# EasyEDA Pro project KeysDock.eprj, board pcb-keyboard-old
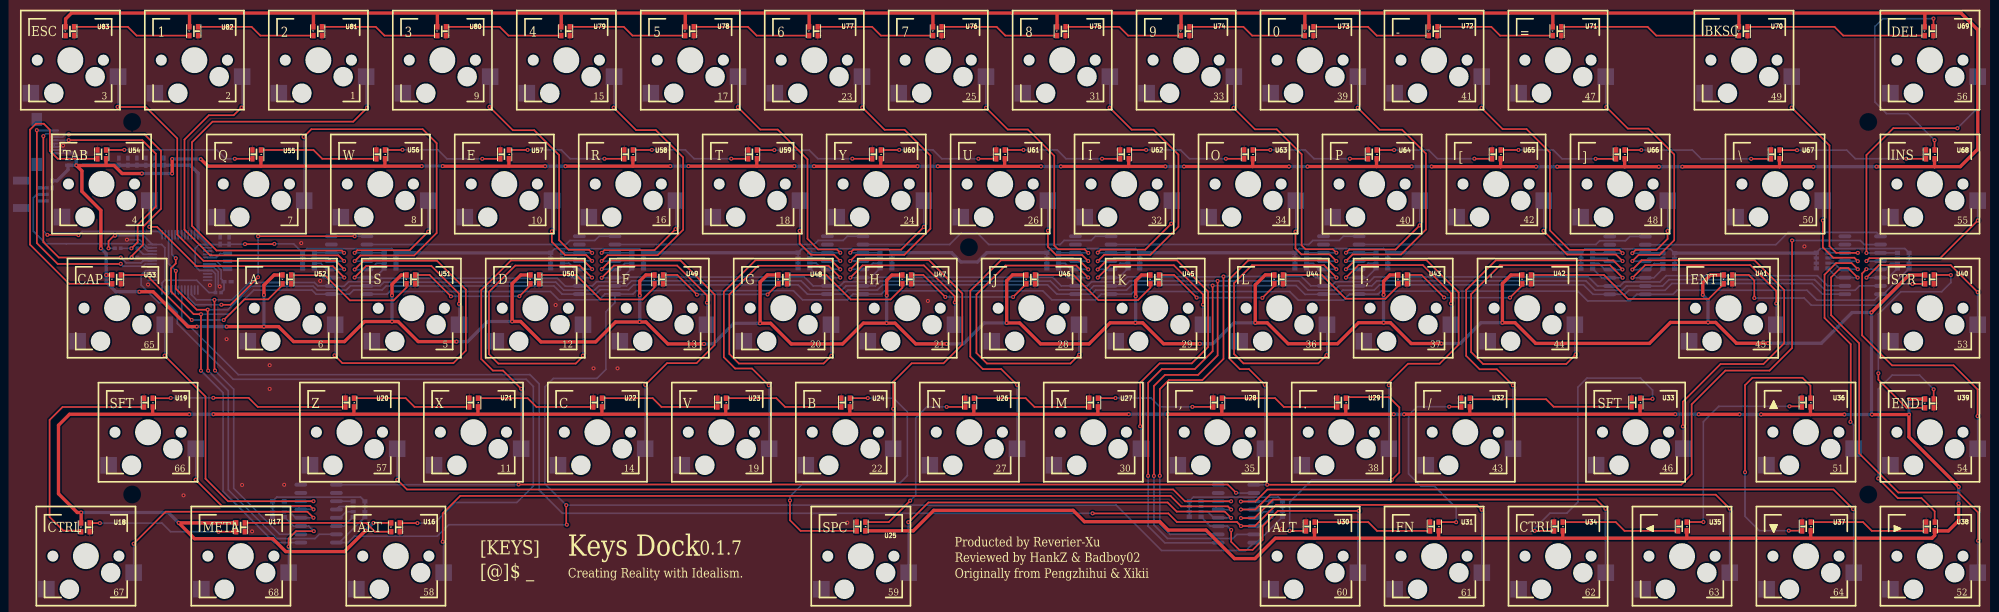
[diagram p9: board, top side]
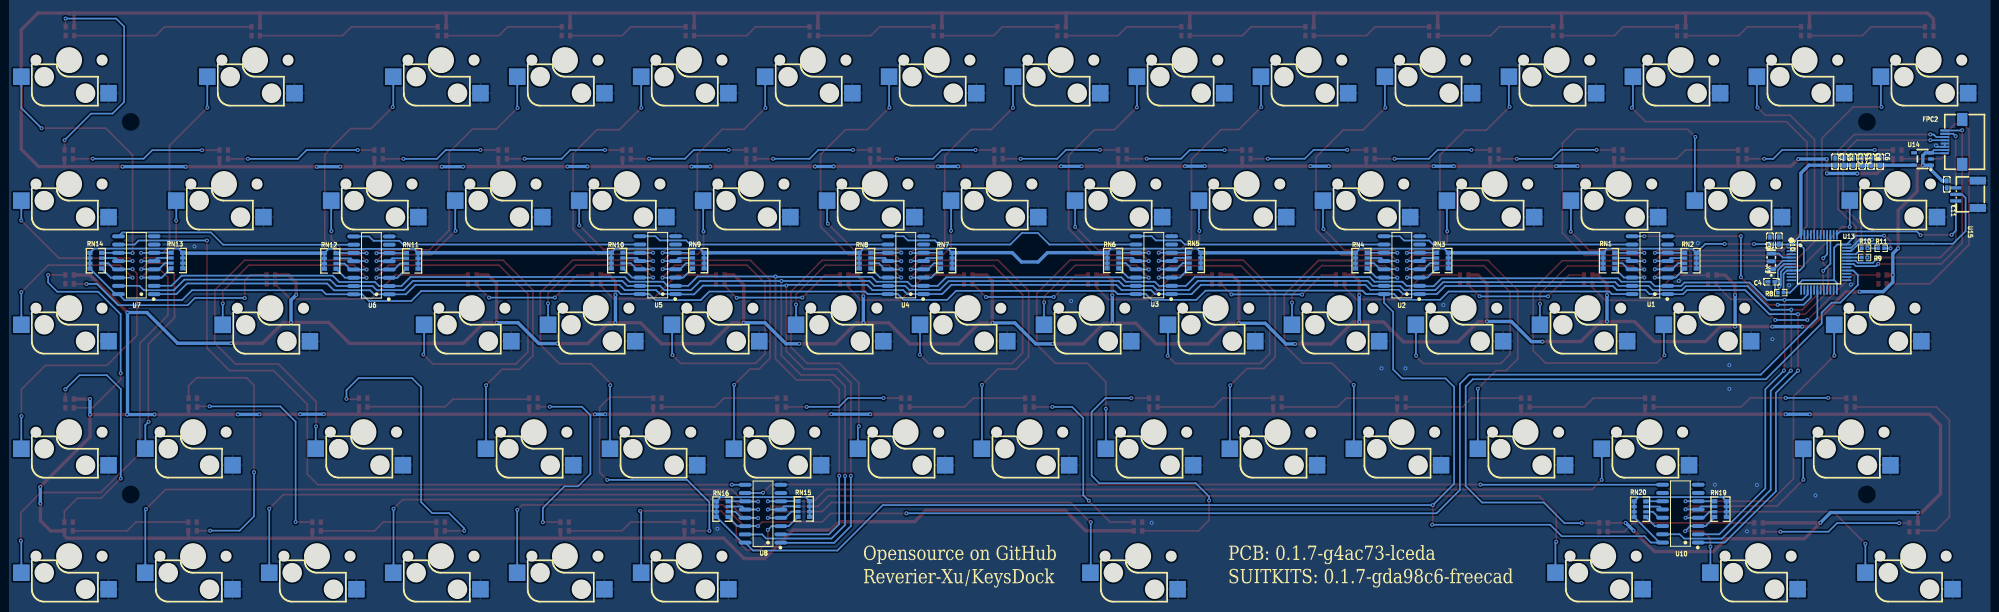
[diagram p10: board, bottom side, seen from below]

Outline 297.62 x 84.78 mm; copper layers: Top Layer, Bottom Layer. Coordinates in mm from the lower left corner of the outline.
Stack: Top Layer 0.035mm / Dielectric1 1.51mm FR4 er 4.5 / Bottom Layer 0.035mm

## Design rules (mm)
template: JLCPCB Capability(Two Layers Board)
spacing copperThickness1oz (default): track to track 0.102, other pairs 0.152 to 0.3
spacing copperThickness2oz: track to track 0.203, other pairs 0.152 to 0.3
track width copperThickness1oz (default): min 0.127, default 0.254, max 2.54
track width copperThickness2oz: min 0.203, default 0.254, max 2.54
differential pair differentialPair (default): width min 0.127, default 0.254, max 2.54; gap min 0.152, default 0.152
via viaSize (default): diameter min 0.5, default 0.61, max 10; hole min 0.3, default 0.305, max 6.3

## Placement (name value [footprint] x y rotation side)
1  -  [轴座_焊接热插拔_不带灯]  44.04 82.79 0 top
2  -  [轴座_焊接热插拔_不带灯]  24.99 82.79 0 top
3  -  [轴座_焊接热插拔_不带灯]  5.93 82.79 0 top
4  -  [轴座_焊接热插拔_不带灯]  10.72 63.76 0 top
5  -  [轴座_焊接热插拔_不带灯]  58.33 44.68 0 top
6  -  [轴座_焊接热插拔_不带灯]  39.28 44.68 0 top
7  -  [轴座_焊接热插拔_不带灯]  34.52 63.75 0 top
8  -  [轴座_焊接热插拔_不带灯]  53.57 63.75 0 top
9  -  [轴座_焊接热插拔_不带灯]  63.09 82.79 0 top
10  -  [轴座_焊接热插拔_不带灯]  72.62 63.75 0 top
11  -  [轴座_焊接热插拔_不带灯]  67.87 25.63 0 top
12  -  [轴座_焊接热插拔_不带灯]  77.38 44.68 0 top
13  -  [轴座_焊接热插拔_不带灯]  96.43 44.68 0 top
14  -  [轴座_焊接热插拔_不带灯]  86.92 25.63 0 top
15  -  [轴座_焊接热插拔_不带灯]  82.15 82.79 0 top
16  -  [轴座_焊接热插拔_不带灯]  91.67 63.75 0 top
17  -  [轴座_焊接热插拔_不带灯]  101.2 82.79 0 top
18  -  [轴座_焊接热插拔_不带灯]  110.72 63.75 0 top
19  -  [轴座_焊接热插拔_不带灯]  105.97 25.63 0 top
20  -  [轴座_焊接热插拔_不带灯]  115.48 44.68 0 top
21  -  [轴座_焊接热插拔_不带灯]  134.54 44.68 0 top
22  -  [轴座_焊接热插拔_不带灯]  125.03 25.63 0 top
23  -  [轴座_焊接热插拔_不带灯]  120.25 82.79 0 top
24  -  [轴座_焊接热插拔_不带灯]  129.77 63.75 0 top
25  -  [轴座_焊接热插拔_不带灯]  139.3 82.79 0 top
26  -  [轴座_焊接热插拔_不带灯]  148.82 63.75 0 top
27  -  [轴座_焊接热插拔_不带灯]  144.08 25.63 0 top
28  -  [轴座_焊接热插拔_不带灯]  153.59 44.68 0 top
29  -  [轴座_焊接热插拔_不带灯]  172.64 44.68 0 top
30  -  [轴座_焊接热插拔_不带灯]  163.13 25.63 0 top
31  -  [轴座_焊接热插拔_不带灯]  158.34 82.79 0 top
32  -  [轴座_焊接热插拔_不带灯]  167.87 63.75 0 top
33  -  [轴座_焊接热插拔_不带灯]  177.39 82.79 0 top
34  -  [轴座_焊接热插拔_不带灯]  186.92 63.75 0 top
35  -  [轴座_焊接热插拔_不带灯]  182.18 25.63 0 top
36  -  [轴座_焊接热插拔_不带灯]  191.69 44.68 0 top
37  -  [轴座_焊接热插拔_不带灯]  210.74 44.68 0 top
38  -  [轴座_焊接热插拔_不带灯]  201.23 25.63 0 top
39  -  [轴座_焊接热插拔_不带灯]  196.44 82.79 0 top
40  -  [轴座_焊接热插拔_不带灯]  205.97 63.75 0 top
41  -  [轴座_焊接热插拔_不带灯]  215.49 82.79 0 top
42  -  [轴座_焊接热插拔_不带灯]  225.02 63.75 0 top
43  -  [轴座_焊接热插拔_不带灯]  220.29 25.63 0 top
44  -  [轴座_焊接热插拔_不带灯]  229.8 44.68 0 top
45  -  [轴座_焊接热插拔_不带灯]  260.75 44.67 0 top
46  -  [轴座_焊接热插拔_不带灯]  246.46 25.64 0 top
47  -  [轴座_焊接热插拔_不带灯]  234.54 82.79 0 top
48  -  [轴座_焊接热插拔_不带灯]  244.08 63.75 0 top
49  -  [轴座_焊接热插拔_不带灯]  263.12 82.79 0 top
50  -  [轴座_焊接热插拔_不带灯]  267.89 63.75 0 top
51  -  [轴座_焊接热插拔_不带灯]  272.64 25.64 0 top
52  -  [轴座_焊接热插拔_不带灯]  291.7 6.58 0 top
53  -  [轴座_焊接热插拔_不带灯]  291.7 44.68 0 top
54  -  [轴座_焊接热插拔_不带灯]  291.7 25.62 0 top
55  -  [轴座_焊接热插拔_不带灯]  291.7 63.75 0 top
56  -  [轴座_焊接热插拔_不带灯]  291.7 82.79 0 top
57  -  [轴座_焊接热插拔_不带灯]  48.82 25.63 0 top
58  -  [轴座_焊接热插拔_不带灯]  55.95 6.59 0 top
59  -  [轴座_焊接热插拔_不带灯]  127.41 6.58 0 top
60  -  [轴座_焊接热插拔_不带灯]  196.45 6.58 0 top
61  -  [轴座_焊接热插拔_不带灯]  215.5 6.58 0 top
62  -  [轴座_焊接热插拔_不带灯]  234.55 6.58 0 top
63  -  [轴座_焊接热插拔_不带灯]  253.6 6.58 0 top
64  -  [轴座_焊接热插拔_不带灯]  272.65 6.58 0 top
65  -  [轴座_焊接热插拔_不带灯]  13.11 44.68 0 top
66  -  [轴座_焊接热插拔_不带灯]  17.87 25.62 0 top
67  -  [轴座_焊接热插拔_不带灯]  8.32 6.59 0 top
68  -  [轴座_焊接热插拔_不带灯]  32.13 6.59 0 top
C4  100nF  [C0402]  30.09 48.75 180 bottom
C5  100nF  [C0402]  18.93 67.19 270 bottom
C6  100nF  [C0402]  13.39 67.19 270 bottom
C7  100nF  [C0402]  20.31 67.19 270 bottom
C8  100nF  [C0402]  14.78 67.19 270 bottom
C9  10uF  [C0402]  30.32 55.06 270 bottom
C10  100nF  [C0402]  28.94 55.07 270 bottom
C11  10uF  [C0402]  3.14 63.71 270 bottom
C12  10uF  [C0402]  17.53 67.18 270 bottom
C13  100nF  [C0402]  16.15 67.19 270 bottom
FPC2  -  [FPC-SMD_P0.50-8P_FGS-XJ-H2.0]  2.11 70.23 270 bottom
R8  10kΩ  [R0402]  28.66 47.07 180 bottom
R9  22Ω  [R0402]  15.77 52.47 180 bottom
R10  22Ω  [R0402]  15.77 53.89 180 bottom
R11  1.5kΩ  [R0402]  13.23 53.89 180 bottom
RN1  10kΩ  [RES-ARRAY-SMD_0603-8P-L3.2-W1.6-BL]  55.06 51.98 90 bottom
RN2  10kΩ  [RES-ARRAY-SMD_0603-8P-L3.2-W1.6-BL]  42.53 51.98 270 bottom
RN3  10kΩ  [RES-ARRAY-SMD_0603-8P-L3.2-W1.6-BL]  80.64 52 90 bottom
RN4  10kΩ  [RES-ARRAY-SMD_0603-8P-L3.2-W1.6-BL]  93.1 51.99 270 bottom
RN5  10kΩ  [RES-ARRAY-SMD_0603-8P-L3.2-W1.6-BL]  118.66 52.01 90 bottom
RN6  10kΩ  [RES-ARRAY-SMD_0603-8P-L3.2-W1.6-BL]  131.27 52.01 270 bottom
RN7  10kΩ  [RES-ARRAY-SMD_0603-8P-L3.2-W1.6-BL]  156.88 51.99 90 bottom
RN8  10kΩ  [RES-ARRAY-SMD_0603-8P-L3.2-W1.6-BL]  169.36 51.99 270 bottom
RN9  10kΩ  [RES-ARRAY-SMD_0603-8P-L3.2-W1.6-BL]  195 51.99 90 bottom
RN10  10kΩ  [RES-ARRAY-SMD_0603-8P-L3.2-W1.6-BL]  207.48 52 270 bottom
RN11  10kΩ  [RES-ARRAY-SMD_0603-8P-L3.2-W1.6-BL]  238.96 51.95 90 bottom
RN12  10kΩ  [RES-ARRAY-SMD_0603-8P-L3.2-W1.6-BL]  251.56 51.94 270 bottom
RN13  10kΩ  [RES-ARRAY-SMD_0603-8P-L3.2-W1.6-BL]  275.13 52 90 bottom
RN14  10kΩ  [RES-ARRAY-SMD_0603-8P-L3.2-W1.6-BL]  287.6 51.98 270 bottom
RN15  10kΩ  [RES-ARRAY-SMD_0603-8P-L3.2-W1.6-BL]  178.78 13.83 90 bottom
RN16  10kΩ  [RES-ARRAY-SMD_0603-8P-L3.2-W1.6-BL]  191.3 13.81 270 bottom
RN19  10kΩ  [RES-ARRAY-SMD_0603-8P-L3.2-W1.6-BL]  37.91 13.81 90 bottom
RN20  10kΩ  [RES-ARRAY-SMD_0603-8P-L3.2-W1.6-BL]  50.29 13.8 270 bottom
U1  -  [SOIC-16_L9.9-W3.9-P1.27-LS6.0-BL]  48.77 51.29 90 bottom
U2  -  [SOIC-16_L9.9-W3.9-P1.27-LS6.0-BL]  86.88 51.29 90 bottom
U3  -  [SOIC-16_L9.9-W3.9-P1.27-LS6.0-BL]  125 51.29 90 bottom
U4  -  [SOIC-16_L9.9-W3.9-P1.27-LS6.0-BL]  163.11 51.29 90 bottom
U5  -  [SOIC-16_L9.9-W3.9-P1.27-LS6.0-BL]  201.23 51.29 90 bottom
U6  -  [SOIC-16_L9.9-W3.9-P1.27-LS6.0-BL]  245.23 51.26 90 bottom
U7  -  [SOIC-16_L9.9-W3.9-P1.27-LS6.0-BL]  281.36 51.28 90 bottom
U8  -  [SOIC-16_L9.9-W3.9-P1.27-LS6.0-BL]  185.05 13.1 90 bottom
U10  -  [SOIC-16_L9.9-W3.9-P1.27-LS6.0-BL]  44.08 13.12 90 bottom
U13  -  [LQFP-48_L7.0-W7.0-P0.50-LS9.0-BL]  22.78 51.72 270 bottom
U14  -  [SOT-25_L3.0-W1.6-P0.95-LS2.8-BL_1]  6.86 67.6 90 bottom
U15  ZX-SH1.0-3PWT  [CONN-SMD_3P-P1.00_MEGASTAR_ZX-SH1.0-3PWT]  0.07 62.17 90 bottom
U16  XL-2020RGBC-2812B  [LED-SMD_4P-L2.0-W2.0-BR-1]  55.96 11.08 0 top
U17  XL-2020RGBC-2812B  [LED-SMD_4P-L2.0-W2.0-BR-1]  32.13 11.08 0 top
U18  XL-2020RGBC-2812B  [LED-SMD_4P-L2.0-W2.0-BR-1]  8.31 11.08 0 top
U19  XL-2020RGBC-2812B  [LED-SMD_4P-L2.0-W2.0-BR-1]  17.86 30.11 180 top
U20  XL-2020RGBC-2812B  [LED-SMD_4P-L2.0-W2.0-BR-1]  48.79 30.12 180 top
U21  XL-2020RGBC-2812B  [LED-SMD_4P-L2.0-W2.0-BR-1]  67.84 30.12 180 top
U22  XL-2020RGBC-2812B  [LED-SMD_4P-L2.0-W2.0-BR-1]  86.89 30.12 180 top
U23  XL-2020RGBC-2812B  [LED-SMD_4P-L2.0-W2.0-BR-1]  105.95 30.12 180 top
U24  XL-2020RGBC-2812B  [LED-SMD_4P-L2.0-W2.0-BR-1]  125 30.12 180 top
U25  XL-2020RGBC-2812B  [LED-SMD_4P-L2.0-W2.0-BR-1]  127.37 11.08 180 top
U26  XL-2020RGBC-2812B  [LED-SMD_4P-L2.0-W2.0-BR-1]  144.05 30.12 180 top
U27  XL-2020RGBC-2812B  [LED-SMD_4P-L2.0-W2.0-BR-1]  163.11 30.12 180 top
U28  XL-2020RGBC-2812B  [LED-SMD_4P-L2.0-W2.0-BR-1]  182.16 30.12 180 top
U29  XL-2020RGBC-2812B  [LED-SMD_4P-L2.0-W2.0-BR-1]  201.21 30.12 180 top
U30  XL-2020RGBC-2812B  [LED-SMD_4P-L2.0-W2.0-BR-1]  196.42 11.08 180 top
U31  XL-2020RGBC-2812B  [LED-SMD_4P-L2.0-W2.0-BR-1]  215.47 11.08 180 top
U32  XL-2020RGBC-2812B  [LED-SMD_4P-L2.0-W2.0-BR-1]  220.27 30.12 180 top
U33  XL-2020RGBC-2812B  [LED-SMD_4P-L2.0-W2.0-BR-1]  246.44 30.12 180 top
U34  XL-2020RGBC-2812B  [LED-SMD_4P-L2.0-W2.0-BR-1]  234.53 11.08 180 top
U35  XL-2020RGBC-2812B  [LED-SMD_4P-L2.0-W2.0-BR-1]  253.59 11.08 180 top
U36  XL-2020RGBC-2812B  [LED-SMD_4P-L2.0-W2.0-BR-1]  272.62 30.12 180 top
U37  XL-2020RGBC-2812B  [LED-SMD_4P-L2.0-W2.0-BR-1]  272.65 11.08 180 top
U38  XL-2020RGBC-2812B  [LED-SMD_4P-L2.0-W2.0-BR-1]  291.71 11.08 180 top
U39  XL-2020RGBC-2812B  [LED-SMD_4P-L2.0-W2.0-BR-1]  291.68 30.12 0 top
U40  XL-2020RGBC-2812B  [LED-SMD_4P-L2.0-W2.0-BR-1]  291.69 49.17 0 top
U41  XL-2020RGBC-2812B  [LED-SMD_4P-L2.0-W2.0-BR-1]  260.73 49.17 0 top
U42  XL-2020RGBC-2812B  [LED-SMD_4P-L2.0-W2.0-BR-1]  229.78 49.17 0 top
U43  XL-2020RGBC-2812B  [LED-SMD_4P-L2.0-W2.0-BR-1]  210.72 49.17 0 top
U44  XL-2020RGBC-2812B  [LED-SMD_4P-L2.0-W2.0-BR-1]  191.67 49.17 0 top
U45  XL-2020RGBC-2812B  [LED-SMD_4P-L2.0-W2.0-BR-1]  172.62 49.17 0 top
U46  XL-2020RGBC-2812B  [LED-SMD_4P-L2.0-W2.0-BR-1]  153.57 49.17 0 top
U47  XL-2020RGBC-2812B  [LED-SMD_4P-L2.0-W2.0-BR-1]  134.52 49.17 0 top
U48  XL-2020RGBC-2812B  [LED-SMD_4P-L2.0-W2.0-BR-1]  115.46 49.17 0 top
U49  XL-2020RGBC-2812B  [LED-SMD_4P-L2.0-W2.0-BR-1]  96.41 49.17 0 top
U50  XL-2020RGBC-2812B  [LED-SMD_4P-L2.0-W2.0-BR-1]  77.36 49.17 0 top
U51  XL-2020RGBC-2812B  [LED-SMD_4P-L2.0-W2.0-BR-1]  58.31 49.17 0 top
U52  XL-2020RGBC-2812B  [LED-SMD_4P-L2.0-W2.0-BR-1]  39.26 49.17 0 top
U53  XL-2020RGBC-2812B  [LED-SMD_4P-L2.0-W2.0-BR-1]  13.09 49.17 0 top
U54  XL-2020RGBC-2812B  [LED-SMD_4P-L2.0-W2.0-BR-1]  10.69 68.25 180 top
U55  XL-2020RGBC-2812B  [LED-SMD_4P-L2.0-W2.0-BR-1]  34.5 68.25 180 top
U56  XL-2020RGBC-2812B  [LED-SMD_4P-L2.0-W2.0-BR-1]  53.55 68.25 180 top
U57  XL-2020RGBC-2812B  [LED-SMD_4P-L2.0-W2.0-BR-1]  72.6 68.25 180 top
U58  XL-2020RGBC-2812B  [LED-SMD_4P-L2.0-W2.0-BR-1]  91.65 68.25 180 top
U59  XL-2020RGBC-2812B  [LED-SMD_4P-L2.0-W2.0-BR-1]  110.7 68.25 180 top
U60  XL-2020RGBC-2812B  [LED-SMD_4P-L2.0-W2.0-BR-1]  129.75 68.25 180 top
U61  XL-2020RGBC-2812B  [LED-SMD_4P-L2.0-W2.0-BR-1]  148.8 68.25 180 top
U62  XL-2020RGBC-2812B  [LED-SMD_4P-L2.0-W2.0-BR-1]  167.85 68.25 180 top
U63  XL-2020RGBC-2812B  [LED-SMD_4P-L2.0-W2.0-BR-1]  186.9 68.25 180 top
U64  XL-2020RGBC-2812B  [LED-SMD_4P-L2.0-W2.0-BR-1]  205.95 68.25 180 top
U65  XL-2020RGBC-2812B  [LED-SMD_4P-L2.0-W2.0-BR-1]  225.01 68.25 180 top
U66  XL-2020RGBC-2812B  [LED-SMD_4P-L2.0-W2.0-BR-1]  244.06 68.25 180 top
U67  XL-2020RGBC-2812B  [LED-SMD_4P-L2.0-W2.0-BR-1]  267.87 68.25 180 top
U68  XL-2020RGBC-2812B  [LED-SMD_4P-L2.0-W2.0-BR-1]  291.69 68.25 180 top
U69  XL-2020RGBC-2812B  [LED-SMD_4P-L2.0-W2.0-BR-1]  291.63 87.3 0 top
U70  XL-2020RGBC-2812B  [LED-SMD_4P-L2.0-W2.0-BR-1]  263.07 87.3 0 top
U71  XL-2020RGBC-2812B  [LED-SMD_4P-L2.0-W2.0-BR-1]  234.46 87.3 0 top
U72  XL-2020RGBC-2812B  [LED-SMD_4P-L2.0-W2.0-BR-1]  215.41 87.3 0 top
U73  XL-2020RGBC-2812B  [LED-SMD_4P-L2.0-W2.0-BR-1]  196.36 87.3 0 top
U74  XL-2020RGBC-2812B  [LED-SMD_4P-L2.0-W2.0-BR-1]  177.32 87.3 0 top
U75  XL-2020RGBC-2812B  [LED-SMD_4P-L2.0-W2.0-BR-1]  158.27 87.3 0 top
U76  XL-2020RGBC-2812B  [LED-SMD_4P-L2.0-W2.0-BR-1]  139.23 87.3 0 top
U77  XL-2020RGBC-2812B  [LED-SMD_4P-L2.0-W2.0-BR-1]  120.18 87.3 0 top
U78  XL-2020RGBC-2812B  [LED-SMD_4P-L2.0-W2.0-BR-1]  101.14 87.3 0 top
U79  XL-2020RGBC-2812B  [LED-SMD_4P-L2.0-W2.0-BR-1]  82.09 87.3 0 top
U80  XL-2020RGBC-2812B  [LED-SMD_4P-L2.0-W2.0-BR-1]  63.04 87.3 0 top
U81  XL-2020RGBC-2812B  [LED-SMD_4P-L2.0-W2.0-BR-1]  44 87.3 0 top
U82  XL-2020RGBC-2812B  [LED-SMD_4P-L2.0-W2.0-BR-1]  24.95 87.3 0 top
U83  XL-2020RGBC-2812B  [LED-SMD_4P-L2.0-W2.0-BR-1]  5.91 87.3 0 top
X1  8MHz  [OSC-SMD_3P-L3.2-W1.3-P1.20-L]  30.11 51.88 90 bottom

## Footprints (pads in the part's own frame, mm; a bottom-side part is the same pattern mirrored in y, then rotated)
C0402
  rect 0.79x0.54 smd: 1(-0.545,0) 2(0.545,0)
CONN-SMD_3P-P1.00_MEGASTAR_ZX-SH1.0-3PWT
  rect 0.5x1.7 smd: 1(-1,1.7) 2(0,1.7) 3(1,1.7)
  rect 1.2x2.5 smd: 4(-2.1,-1.7) 5(2.1,-1.7)
FPC-SMD_P0.50-8P_FGS-XJ-H2.0
  rect 0.3x1.3 smd: 1(-1.75,-1.34) 2(-1.252,-1.339) 3(-0.75,-1.34) 4(-0.25,-1.34) 5(0.25,-1.34) 6(0.75,-1.34) 7(1.25,-1.34) 8(1.75,-1.34)
  rect 2x1.6 smd: 9(3.45,1.34) 10(-3.45,1.34)
LED-SMD_4P-L2.0-W2.0-BR-1
  rect 0.65x0.85 smd: 1(-0.714,0.611) 2(-0.714,-0.739) 3(0.586,-0.739) 4(0.586,0.611)
LQFP-48_L7.0-W7.0-P0.50-LS9.0-BL
  oval 0.27x1.5 smd: 1(-2.75,-4.25) 2(-2.25,-4.25) 3(-1.75,-4.25) 4(-1.25,-4.25) 5(-0.75,-4.25) 6(-0.25,-4.25) 7(0.25,-4.25) 8(0.75,-4.25) 9(1.25,-4.25) 10(1.75,-4.25) 11(2.25,-4.25) 12(2.75,-4.25) 25(2.75,4.25) 26(2.25,4.25) 27(1.75,4.25) 28(1.25,4.25) 29(0.75,4.25) 30(0.25,4.25) 31(-0.25,4.25) 32(-0.75,4.25) 33(-1.25,4.25) 34(-1.75,4.25) 35(-2.25,4.25) 36(-2.75,4.25)
  oval 1.5x0.27 smd: 13(4.25,-2.75) 14(4.25,-2.25) 15(4.25,-1.75) 16(4.25,-1.25) 17(4.25,-0.75) 18(4.25,-0.25) 19(4.25,0.25) 20(4.25,0.75) 21(4.25,1.25) 22(4.25,1.75) 23(4.25,2.25) 24(4.25,2.75) 37(-4.25,2.75) 38(-4.25,2.25) 39(-4.25,1.75) 40(-4.25,1.25) 41(-4.25,0.75) 42(-4.25,0.25) 43(-4.25,-0.25) 44(-4.25,-0.75) 45(-4.25,-1.25) 46(-4.25,-1.75) 47(-4.25,-2.25) 48(-4.25,-2.75)
OSC-SMD_3P-L3.2-W1.3-P1.20-L
  rect 0.6x1.399 smd: 1(-1.199,0) 2(0,0) 3(1.199,0)
R0402
  rect 0.566x0.54 smd: 1(-0.433,0) 2(0.433,0)
RES-ARRAY-SMD_0603-8P-L3.2-W1.6-BL
  rect 0.65x0.8 smd: 1(-1.2,-0.9) 4(1.2,-0.9) 5(1.2,0.9) 8(-1.2,0.9)
  rect 0.5x0.8 smd: 2(-0.4,-0.9) 3(0.4,-0.9) 6(0.4,0.9) 7(-0.4,0.9)
SOIC-16_L9.9-W3.9-P1.27-LS6.0-BL
  oval 0.602x1.971 smd: 1(-4.445,-2.736) 2(-3.175,-2.736) 3(-1.905,-2.736) 4(-0.635,-2.736) 5(0.635,-2.736) 6(1.905,-2.736) 7(3.175,-2.736) 8(4.445,-2.736) 9(4.445,2.736) 10(3.175,2.736) 11(1.905,2.736) 12(0.635,2.736) 13(-0.635,2.736) 14(-1.905,2.736) 15(-3.175,2.736) 16(-4.445,2.736)
SOT-25_L3.0-W1.6-P0.95-LS2.8-BL_1
  rect 0.5x0.899 smd: 1(-0.95,-1.3) 2(0,-1.3) 3(0.95,-1.3) 4(0.95,1.3) 5(-0.95,1.3)
轴座_焊接热插拔_不带灯
  rect 2.55x2.55 smd far side: 1(-6.066,-5.08) 2(7.335,-2.54)

## Nets
As in the schematic.

Pads without a net: FPC2 9 10; U1 7; U2 7; U3 7; U4 7; U5 7; U6 7; U7 7; U8 7; U10 7 10; U13 2 3 4 10 11 12 13 14 17 19 20 21 22 25 27 29 38 41 42 43 45 46; U14 4

## Via types
v1: diameter 0.61, hole 0.305, Top Layer to Bottom Layer, 343 vias

## Routing (per net, layer and track width the routed paths; a pad name or vN(x,y) marks a point on that pad's centre or on a via; arc(x,y) is an arc through that point)
GND: length 10.6
  Bottom Layer w0.254: v1(14.63,55.2) 16.58,55.2 17.81,53.97 U13.35 ; U13.8 27.95,50.97 28.64,50.28 28.64,48.25 v1(28.88,48.01) ; v1(4.81,69.67) 4.62,69.48 FPC2.6 FPC2.5
  vias: v1(17.87,48.31) v1(23.32,15.92) v1(27.37,48.21) v1(29.94,39.92) v1(32.32,17.52) v1(33.86,10.39) v1(36.56,35.92) v1(36.56,32.28) v1(38.79,17.55) v1(41.41,54.68) v1(44.33,48.87) v1(80.5,45.17) v1(86.33,35.44) v1(90.02,35.44) v1(125.33,11.72) v1(137.71,45.79) v1(192.06,10.8) v1(272.41,54.17)
VCC_3V3: length 855.9
  Top Layer w0.254: v1(82.23,11.41) 82.13,11.5 v1(82.13,14.42) ; v1(32.77,54.53) 37.25,54.53 v1(37.28,54.56) ; v1(11.8,53.88) 11.8,54.99 12.63,55.82 v1(12.79,55.82)
  Bottom Layer w0.254: 47.26,8.67 U10.16 ; 47.26,8.67 RN20.4 RN20.3 RN20.2 RN20.1 50.53,15.66 37.66,15.66 RN19.4 RN19.3 RN19.2 RN19.1 ; 47.26,8.67 48.61,8.67 49.59,9.65 62.32,9.65 64.08,11.41 v1(82.23,11.41) ; RN2.8 RN2.7 RN2.6 RN2.5 ; RN2.8 40.25,54.56 v1(37.28,54.56) ; RN2.8 42.28,53.83 55.31,53.83 RN1.5 RN1.6 RN1.7 RN1.8 ; U2.16 89.62,45.52 88.23,44.13 88.23,35.27 86.85,33.89 80.16,33.89 78.86,32.59 78.86,17.7 v1(82.13,14.42) 166.64,14.42 173.62,7.45 186.58,7.45 U8.16 188.25,8.65 RN16.4 RN16.3 RN16.2 RN16.1 191.56,15.66 178.51,15.66 177.88,15.03 RN15.3 RN15.1 ; U2.16 92.4,46.84 92.93,47.37 117.04,47.37 118.46,45.96 125.33,45.96 126.21,46.84 U3.16 130.54,46.84 131.05,47.35 155.37,47.35 156.76,45.96 163.45,45.96 164.34,46.85 165.84,46.85 U4.16 168.97,46.84 169.37,47.24 193.31,47.24 194.63,45.92 201.59,45.92 202.51,46.84 U5.16 206.89,46.84 207.35,47.3 237.58,47.3 239.1,45.79 245.63,45.79 246.65,46.81 252.2,46.81 252.83,47.44 272.8,47.44 274.32,45.92 283.18,45.92 U7.16 284.55,46.83 RN14.4 RN14.3 RN14.2 RN14.1 287.84,53.84 274.87,53.84 RN13.4 RN13.3 RN13.2 RN13.1 ; U2.16 89.59,46.87 88.1,46.87 87.2,45.97 80.98,45.97 79.7,47.24 55.01,47.24 54.61,46.84 U1.16 ; v1(11.8,53.88) 12.79,53.88 R11.2 ; RN5.1 RN5.2 RN5.3 RN5.4 118.38,53.83 131.55,53.83 RN6.1 RN6.2 RN6.3 RN6.4 ; v1(32.77,54.53) 32.75,54.51 C9.2 ; 20.57,48.97 25.34,48.97 27.23,47.07 R8.2 28.23,49.97 27.73,50.47 U13.9 25.77,50.47 25.11,51.13 25.11,53.87 25.71,54.47 U13.1 ; 20.57,48.97 20.43,48.97 20.03,48.57 U13.24 ; 20.57,48.97 20.46,49.08 20.46,53.97 19.96,54.47 U13.36 17.18,55.82 v1(12.79,55.82) ; RN12.4 RN12.3 RN12.2 RN12.1 251.8,53.8 238.71,53.8 RN11.4 RN11.3 RN11.2 RN11.1 ; RN4.4 RN4.3 RN4.2 RN4.1 93.36,53.83 80.37,53.83 RN3.4 RN3.3 RN3.2 RN3.1 ; 25.57,55.97 U13.48 U13.1 ; U13.1 30.18,54.47 ; RN8.4 RN8.3 RN8.2 RN8.1 169.61,53.84 156.63,53.84 RN7.4 RN7.3 RN7.2 RN7.1 ; 30.27,54.56 30.32,54.61 ; RN10.4 RN10.3 RN10.2 RN10.1 207.74,53.84 194.75,53.84 RN9.4 RN9.3 RN9.2 RN9.1
  Bottom Layer w0.508: RN11.4 238.01,53.2 RN10.1 ; 25.57,55.97 25.57,65.42 24.34,66.65 U14.5 ; RN3.4 79.72,53.18 RN1.5 ; RN13.4 274.17,53.14 RN12.1 ; RN4.1 117.73,53.19 RN5.4 ; RN7.4 155.96,53.21 146.76,53.21 145.33,51.78 142.78,51.78 141.35,53.21 RN6.1 ; RN8.1 RN9.4
VCC_5V: length 1719.8
  Top Layer w0.254: v1(52.51,11.69) U16.1
  Top Layer w0.508: v1(256.79,46.73) 256.79,48.59 257.98,49.78 260.02,49.78 ; v1(25.36,41.85) 24.01,41.85 18.65,47.21 v1(16.54,47.21) ; U17.1 31.41,11.7 v1(22.58,11.7) 25.01,9.27 37.05,9.27 39.03,7.29 48.07,7.29 v1(51.27,10.49) ; v1(16.91,65.37) 13.88,65.37 12.64,66.61 11.41,66.61 ; 18.55,28.38 5.8,28.38 4.11,26.69 4.11,16.17 6.99,13.29 v1(7.59,13.29) 7.59,11.69 U18.1 ; 18.55,28.38 v1(24.2,28.38) ; 18.55,28.38 18.57,28.4 U19.1 ; 130.44,66.48 120.22,66.48 v1(120.21,66.49) ; 130.44,66.48 v1(136.11,66.48) ; 130.44,66.48 130.47,66.5 U60.1 ; v1(65.28,39.55) 59.38,39.55 56.3,42.63 v1(55.36,42.63) 51.14,42.63 48.06,39.55 40.23,39.55 37.93,41.85 v1(35.68,41.85) v1(29.95,41.85) ; 81.37,90.03 81.37,87.91 U79.1 ; 81.37,90.03 100.39,90.03 ; 81.37,90.03 62.34,90.03 ; U54.1 11.41,67.63 11.41,66.61 ; U33.1 247.15,29.5 247.15,28.39 ; 220.98,28.39 220.98,28.39 U32.1 ; 220.98,28.39 247.15,28.39 ; 220.98,28.39 210.91,28.39 v1(210.89,28.37) ; 201.92,28.38 201.92,29.5 U29.1 ; 201.92,28.38 v1(209.31,28.38) ; 201.92,28.38 182.9,28.38 ; 292.42,66.43 292.4,66.44 U68.1 ; 292.42,66.43 296.36,66.43 299.05,69.12 299.05,87.44 296.46,90.03 290.89,90.03 ; 292.42,66.43 v1(283.49,66.43) ; v1(296.12,17.23) 296.12,17.26 288.48,24.9 v1(288.48,28.33) 288.47,28.33 v1(282.79,28.33) ; 138.48,90.03 138.48,87.94 U76.1 ; 138.48,90.03 119.47,90.03 ; 138.48,90.03 157.57,90.03 ; U75.1 157.56,90.02 157.57,90.03 ; 182.9,28.38 182.87,28.4 U28.1 ; 182.9,28.38 174.61,28.38 v1(174.59,28.4) ; 24.27,90.03 43.28,90.03 ; 24.27,90.03 24.24,90 U82.1 ; 24.27,90.03 6.11,90.03 5.19,89.11 U83.1 ; 43.28,90.03 62.34,90.03 ; 43.28,90.03 U81.1 ; U62.1 168.57,66.46 168.56,66.46 ; v1(63.16,66.51) 63.18,66.49 73.32,66.49 ; U23.1 106.64,29.48 106.64,28.39 ; 235.27,9.34 216.15,9.34 ; 235.27,9.34 254.33,9.34 ; 235.27,9.34 235.27,10.44 U34.1 ; 216.15,9.34 197.12,9.34 ; 216.15,9.34 216.19,9.37 U31.1 ; 197.12,9.34 197.12,10.46 U30.1 ; 197.12,9.34 191.1,9.34 187.97,6.21 184.83,6.21 180.45,10.58 174.64,10.58 173.35,11.88 161.76,11.88 160.02,13.62 138.62,13.62 135.48,10.48 128.09,10.48 U25.1 ; 62.34,90.03 62.33,90.02 U80.1 ; 119.47,90.03 U77.1 ; 119.47,90.03 100.39,90.03 ; 106.64,28.39 87.61,28.39 ; 106.64,28.39 125.71,28.39 ; v1(55.36,46.66) 55.36,48.35 56.79,49.78 U51.1 ; 206.65,66.45 196.06,66.45 v1(196.05,66.44) ; 206.65,66.45 v1(212.04,66.45) ; 206.65,66.45 206.65,67.61 U64.1 ; 125.71,28.39 144.73,28.39 ; 125.71,28.39 125.71,29.5 U24.1 ; 144.73,28.39 163.82,28.39 ; 144.73,28.39 144.77,28.42 U26.1 ; 87.61,28.39 87.61,29.5 U22.1 ; 87.61,28.39 68.56,28.39 ; 100.39,90.03 100.42,90 U78.1 ; v1(140.57,39.2) 135.84,39.2 132.66,42.38 v1(131.37,42.38) 127.79,42.38 124.6,39.19 116.71,39.19 113.54,42.36 v1(111.93,42.36) 111.93,48.68 113.04,49.79 114.74,49.79 U48.1 ; v1(179.5,39.22) 173.92,39.22 170.71,42.43 v1(169.59,42.43) 165.72,42.43 162.49,39.2 155.02,39.2 151.81,42.41 v1(149.82,42.41) 149.82,48.89 150.73,49.8 152.84,49.8 U46.1 ; 157.57,90.03 176.61,90.03 ; U56.1 54.26,66.51 54.27,66.5 ; U73.1 195.63,87.92 195.63,90.03 ; 149.51,66.47 139.25,66.47 v1(139.24,66.48) ; 149.51,66.47 v1(155.09,66.47) ; 149.51,66.47 149.51,67.63 U61.1 ; v1(35.68,46.71) 35.68,48.22 37.24,49.78 U52.1 ; 254.33,9.34 273.37,9.34 ; 254.33,9.34 254.33,10.44 U35.1 ; v1(278.56,28.35) 273.35,28.35 ; 273.35,28.35 265.76,28.35 v1(265.75,28.36) ; 273.35,28.35 273.33,28.37 U36.1 ; 11.41,66.61 6.86,66.61 ; U40.1 288.47,49.78 v1(282.71,44.02) ; v1(27.92,28.38) 27.93,28.39 49.51,28.39 ; U57.1 73.32,67.63 73.32,66.49 ; 233.71,90.03 233.74,89.99 U71.1 ; 233.71,90.03 262.35,90.03 ; 233.71,90.03 214.59,90.03 ; v1(93.43,46.66) 93.43,48.85 94.37,49.79 95.69,49.79 U49.1 ; 6.86,66.61 7.7,65.77 7.7,62.63 10.62,59.71 v1(10.62,53.88) ; 6.86,66.61 v1(6.84,66.62) ; 176.61,90.03 176.61,87.92 U74.1 ; 176.61,90.03 195.63,90.03 ; 163.82,28.39 163.82,29.5 ; 163.82,28.39 v1(168.58,28.39) ; 35.21,66.5 27.06,66.5 v1(25.98,67.58) ; 35.21,66.5 35.21,67.63 U55.1 ; 35.21,66.5 54.27,66.5 ; 244.78,66.42 v1(250.04,66.42) ; 244.78,66.42 v1(234.42,66.42) ; 244.78,66.42 244.78,67.62 U66.1 ; U63.1 187.62,66.45 187.61,66.45 ; 49.51,28.39 68.56,28.39 ; 49.51,28.39 49.5,28.4 U20.1 ; 273.37,9.34 273.37,10.46 U37.1 ; 273.37,9.34 292.01,9.34 292.42,9.75 U38.1 294.54,10.47 296.1,12.03 v1(296.1,14.67) ; 73.32,66.49 v1(78.88,66.49) ; 68.56,28.39 68.55,28.39 U21.1 ; v1(288.47,30.72) 290.95,30.72 290.96,30.73 ; 290.89,90.03 290.91,90 U69.1 ; 290.89,90.03 262.35,90.03 ; 75.15,49.78 73.82,48.45 v1(73.82,42.64) 75.12,42.64 78.26,39.5 86.65,39.5 89.71,42.56 v1(93.42,42.56) 94.38,42.56 97.75,39.19 v1(103.31,39.19) ; v1(262.44,28.37) 256.18,28.37 v1(256.17,28.38) ; 262.35,90.03 262.35,87.91 ; v1(11.43,49.78) 12.37,49.78 ; v1(215.11,66.45) 215.13,66.43 225.71,66.43 ; v1(266.81,39.29) 261.97,39.29 258.77,42.49 v1(257.59,42.49) 251.81,42.49 248.59,39.27 231.12,39.27 227.94,42.45 v1(226,42.45) 226,48.47 227.31,49.78 229.06,49.78 ; U43.1 210,49.79 208.71,49.79 207.73,48.81 v1(207.73,46.72) ; 195.63,90.03 214.59,90.03 ; 214.59,90.03 214.7,89.92 U72.1 ; 168.56,66.46 v1(174.2,66.46) ; 168.56,66.46 v1(158.15,66.46) ; 247.15,28.39 v1(252.55,28.39) ; 268.58,66.42 U67.1 ; 92.37,66.5 82.02,66.5 v1(82.01,66.49) ; 92.37,66.5 v1(98.12,66.5) ; 92.37,66.5 92.37,67.63 U58.1 ; 225.71,66.43 v1(231.16,66.43) ; 225.71,66.43 225.72,66.44 U65.1 ; 187.61,66.45 v1(193.2,66.45) ; 187.61,66.45 v1(177.07,66.45) ; v1(21.57,65.38) 21.58,65.39 v1(21.58,67.6) ; v1(169.64,46.5) 169.64,48.88 170.54,49.78 U45.1 ; U47.1 133.79,49.77 132.18,49.77 131.38,48.97 v1(131.38,46.63) ; U59.1 111.41,66.5 111.41,66.5 ; v1(273.77,66.42) v1(253.65,66.42) ; 54.27,66.5 v1(59.92,66.5) ; U44.1 190.94,49.8 189.57,49.8 188.02,48.25 v1(188.02,42.43) 189.86,42.43 193.07,39.22 200.66,39.22 203.89,42.45 v1(207.75,42.45) 208.78,42.45 211.98,39.25 v1(216.63,39.25) ; 111.41,66.5 v1(117.18,66.5) ; 111.41,66.5 v1(100.92,66.5) ; 75.15,49.78 U50.1
  Bottom Layer w0.254: FPC2.8 5.49,68.48 U14.3 5.13,68.98 FPC2.7
  Bottom Layer w0.508: v1(140.57,39.2) 143.15,39.2 146.36,42.41 v1(149.82,42.41) ; v1(131.37,42.38) 131.37,46.62 v1(131.38,46.63) ; U14.3 6.42,68.55 6.83,68.14 6.83,66.64 6.82,66.65 U14.1 5.56,65.94 3.87,64.25 3.15,64.25 C11.1 ; v1(21.57,65.38) 16.92,65.38 v1(16.91,65.37) ; v1(117.18,66.5) 117.19,66.49 v1(120.21,66.49) ; v1(193.2,66.45) 193.21,66.44 v1(196.05,66.44) ; v1(25.98,67.58) 25.96,67.6 v1(21.58,67.6) ; v1(139.24,66.48) v1(136.11,66.48) ; v1(158.15,66.46) 155.1,66.46 v1(155.09,66.47) ; v1(103.31,39.19) 104.71,39.19 107.88,42.36 v1(111.93,42.36) ; v1(25.36,41.85) v1(29.95,41.85) ; v1(188.02,42.43) 184.74,42.43 181.53,39.22 v1(179.5,39.22) ; v1(55.36,42.63) v1(55.36,46.66) ; v1(231.16,66.43) 231.17,66.42 v1(234.42,66.42) ; v1(7.59,13.29) 20.99,13.29 v1(22.58,11.7) ; v1(252.55,28.39) 256.16,28.39 v1(256.17,28.38) ; v1(93.42,42.56) 93.43,42.57 v1(93.43,46.66) ; v1(52.51,11.69) 52.47,11.69 v1(51.27,10.49) ; v1(174.2,66.46) 174.21,66.45 v1(177.07,66.45) ; v1(207.73,46.72) 207.73,42.47 v1(207.75,42.45) ; v1(273.77,66.42) 273.78,66.43 v1(283.49,66.43) ; v1(288.48,28.33) 288.48,30.71 v1(288.47,30.72) ; v1(169.64,46.5) 169.64,42.48 v1(169.59,42.43) ; v1(257.59,42.49) 257.59,45.92 v1(256.79,46.73) ; v1(73.82,42.64) 70.06,42.64 66.97,39.55 v1(65.28,39.55) ; v1(82.01,66.49) v1(78.88,66.49) ; v1(265.75,28.36) 262.45,28.36 v1(262.44,28.37) ; v1(296.1,14.67) 296.12,14.69 v1(296.12,17.23) ; v1(16.54,47.21) 16.53,47.22 12.91,47.22 11.44,48.69 11.44,53.06 v1(10.62,53.88) ; v1(35.68,41.85) v1(35.68,46.71) ; v1(226,42.45) 222.7,42.45 219.5,39.25 v1(216.63,39.25) ; v1(253.65,66.42) v1(250.04,66.42) ; v1(266.81,39.29) 275.01,39.29 279.74,44.02 v1(282.71,44.02) 282.71,28.41 v1(282.79,28.33) 278.57,28.33 v1(278.56,28.35) ; v1(209.31,28.38) 209.32,28.37 v1(210.89,28.37) ; v1(63.16,66.51) 59.93,66.51 v1(59.92,66.5) ; v1(24.2,28.38) v1(27.92,28.38) ; v1(168.58,28.39) 168.59,28.4 v1(174.59,28.4) ; v1(215.11,66.45) v1(212.04,66.45) ; v1(100.92,66.5) v1(98.12,66.5)
FN_KEY: length 243.4
  Top Layer w0.254: v1(222.81,13.71) 222.06,14.46 191.21,14.46 187.96,11.21 v1(185.83,11.21) 185.2,11.84 175.97,11.84 174.66,13.15 163.03,13.15 v1(163.02,13.16)
  Bottom Layer w0.254: v1(222.81,13.71) 222.83,13.68 61.2 ; RN16.5 188.99,11.19 U8.14 187.78,11.21 v1(185.83,11.21) ; v1(163.02,13.16) 163.01,13.17 81.55,13.17 77.97,16.75 77.97,33.05 76.55,34.47 31.73,34.47 23.03,43.17 U13.18
NRST: length 6.3
  Bottom Layer w0.254: R8.1 29.54,47.52 29.54,48.75 29.1,49.19 29.1,50.53 28.16,51.47 U13.7
OSC32_IN: length 3.3
  Bottom Layer w0.254: X1.3 28.95,53.07 28.34,52.47 U13.5
OSC33_OUT: length 3.6
  Bottom Layer w0.254: X1.1 29.63,50.68 28.34,51.97 U13.6
RGB_KEY: length 18.3
  Top Layer w0.254: v1(56.97,69.01) 56.95,68.99 U56.2 ; U57.4 72,67.63 v1(69.23,67.63)
  Bottom Layer w0.254: v1(69.23,67.63) 63.8,67.63 62.42,69.01 v1(56.97,69.01)
SCAN_CE: length 391
  Top Layer w0.254: v1(182.23,48.86) 182.23,37.43 179.23,34.43 174.14,34.43 172.45,32.74 v1(172.45,18.9) ; v1(22.14,50.41) 22.14,47.67 25.36,44.45 v1(27.03,44.45) 27.03,35.15 v1(27.11,35.08)
  Bottom Layer w0.254: U8.15 187.79,9.92 185.2,9.92 184.58,9.3 174.53,9.3 172.45,11.38 v1(172.45,18.9) ; v1(27.03,44.45) 30.15,44.45 33.77,48.07 43.25,48.07 43.87,47.45 48.31,47.45 48.97,48.11 53.54,48.11 54.11,48.68 80.53,48.68 81.75,47.46 86.5,47.46 87.14,48.1 89.6,48.1 89.62,48.11 91.4,48.11 92.17,48.88 118.22,48.88 119.63,47.47 124.5,47.47 125.14,48.11 129.63,48.11 130.36,48.84 156.54,48.84 157.88,47.5 162.59,47.5 163.2,48.11 167.96,48.11 168.71,48.86 v1(182.23,48.86) 194.72,48.86 196.12,47.46 200.22,47.46 200.88,48.12 203.96,48.12 203.97,48.11 205.92,48.11 206.68,48.87 238.85,48.87 240.26,47.46 244.43,47.46 245.06,48.09 247.96,48.09 U6.15 250.6,48.08 251.59,49.07 273.97,49.07 275.6,47.44 280.2,47.44 280.88,48.12 284.08,48.12 U7.15 ; v1(27.11,35.08) 30.2,31.99 30.2,16.77 37.68,9.29 43.53,9.29 44.18,9.94 46.81,9.94 ; v1(22.14,50.41) 21.03,51.52 U13.39
SCAN_PL: length 376.7
  Top Layer w0.254: v1(181.47,48.16) 181.47,38.07 178.73,35.33 173.65,35.33 171.55,33.23 v1(171.55,18.92) ; v1(22.13,52.36) 22.13,51.55 21.4,50.82 21.4,47.24 24.88,43.75 v1(26,43.75) 26,35.08 v1(26,35.08)
  Bottom Layer w0.254: U8.1 182.29,8.63 174.11,8.63 171.55,11.19 v1(171.55,18.92) ; U7.1 278.62,46.84 275.2,46.84 273.57,48.47 252.03,48.47 250.99,47.43 245.43,47.43 244.81,46.81 242.49,46.81 242.49,46.81 239.93,46.81 238.47,48.27 207.12,48.27 206.31,47.46 201.49,47.46 200.87,46.84 U5.1 198.45,46.8 195.64,46.8 194.29,48.16 v1(181.47,48.16) 181.36,48.27 169.05,48.27 168.24,47.46 163.51,47.46 162.89,46.84 U4.1 160.37,46.85 157.52,46.85 156.1,48.27 130.76,48.27 129.96,47.47 125.44,47.47 124.81,46.84 U3.1 122.25,46.83 119.2,46.83 117.77,48.26 92.48,48.26 91.72,47.5 87.34,47.5 86.68,46.84 U2.1 84.14,46.84 81.49,46.84 80.24,48.09 54.46,48.09 53.85,47.48 49.46,47.48 48.82,46.84 U1.1 46.02,46.83 43.69,46.83 43.06,47.46 34.11,47.46 30.4,43.75 v1(26,43.75) ; U13.40 21.53,52.96 v1(22.13,52.36) ; v1(26,35.08) 29.4,31.68 29.4,16.54 37.26,8.67 U10.1
SPI1_CLK: length 361.4
  Top Layer w0.254: v1(28.07,45.96) 28.07,35.18 v1(28.16,35.09) ; v1(173.35,18.93) 173.35,32.24 174.74,33.63 179.88,33.63 183.13,36.88 v1(183.13,49.55)
  Bottom Layer w0.254: 46.09,48.05 47.99,48.05 48.68,48.74 53.14,48.74 53.67,49.27 80.78,49.27 81.99,48.05 84.09,48.05 84.15,48.11 86.15,48.11 86.79,48.75 91.1,48.75 91.82,49.47 118.71,49.47 120.07,48.11 122.26,48.11 122.26,48.11 124.21,48.11 124.84,48.74 129.3,48.74 129.99,49.43 156.9,49.43 158.21,48.11 162.22,48.11 162.85,48.74 167.59,48.74 168.35,49.5 183.08,49.5 v1(183.13,49.55) 195.12,49.55 196.55,48.12 198.49,48.12 198.49,48.11 199.73,48.11 200.37,48.75 205.57,48.75 206.3,49.48 239.22,49.48 240.61,48.09 242.49,48.09 U6.2 244.06,48.08 244.69,48.71 250.2,48.71 251.17,49.68 274.39,49.68 275.94,48.13 278.6,48.13 U7.2 ; v1(28.16,35.09) 31.03,32.23 31.03,17.01 38.09,9.94 41.34,9.94 ; v1(173.35,18.93) 173.35,11.52 174.94,9.92 U8.2 ; 46.03,48.11 43.95,48.11 43.44,48.63 33.46,48.63 30.79,45.96 v1(28.07,45.96) 25.33,45.96 24.53,46.77 U13.15
SPI1_MISO: length 37.1
  Top Layer w0.254: v1(34.78,55.74) 49.61,55.74 v1(49.62,55.73) ; v1(34.78,49.44) 30.55,45.21 v1(29.14,45.21)
  Bottom Layer w0.254: v1(29.14,45.21) 25.13,45.21 24.03,46.31 U13.16 ; v1(34.78,49.44) v1(34.78,55.74) ; U1.9 51.5,55.73 v1(49.62,55.73)
SPI2_MOSI: length 109.4
  Top Layer w0.254: U16.4 56.57,11.66 v1(59.26,11.66)
  Bottom Layer w0.254: U13.28 17.52,50.47 16.81,49.76 16.81,48.24 19.52,45.53 20.84,45.53 22.37,44 22.37,42.33 30.94,33.76 75.97,33.76 77.08,32.65 77.08,17.36 74.55,14.83 65.07,14.83 61.9,11.66 v1(59.26,11.66)
SWCLK: length 23.8
  Top Layer w0.254: v1(7.17,55.9) 7.12,55.95 v1(2.4,55.95)
  Bottom Layer w0.254: v1(7.17,55.9) 7.74,56.47 19.53,56.47 U13.37 ; 1.57,61.17 1.75,61.17 1.75,56.6 v1(2.4,55.95)
SWDIO: length 27
  Bottom Layer w0.254: U13.34 17.91,53.47 17.83,53.55 17.72,53.55 16.68,54.59 5.35,54.59 5.34,54.58 2.18,54.58 0.25,56.51 0.25,61.63 0.79,62.17 U15.2 2.38,62.17
UART_RX: length 36.9
  Top Layer w0.254: v1(1.78,71.12) 1.78,54.84 4.15,52.47 v1(13.68,52.47)
  Bottom Layer w0.254: v1(13.68,52.47) 14.51,51.64 16.8,51.64 17.13,51.97 U13.31 ; v1(1.78,71.12) 2.14,71.48 4.07,71.48
UART_TX: length 40
  Top Layer w0.254: v1(13.68,51.5) 13.65,51.47 3.98,51.47 0.78,54.68 v1(0.78,72.03)
  Bottom Layer w0.254: v1(13.68,51.5) 14.04,51.14 17.12,51.14 17.45,51.47 U13.30 ; 4.07,71.98 0.83,71.98 v1(0.78,72.03)
USB_D_N: length 2.3
  Bottom Layer w0.254: R9.1 U13.32
USB_D_P: length 2.7
  Bottom Layer w0.254: R10.1 17.12,52.97 U13.33
USB_PORT_N: length 35.9
  Top Layer w0.254: v1(5.68,71.37) 17.33,71.37 19.86,68.84 19.86,59.95 17.1,57.19 17.1,54.44 15.34,52.68 v1(15.34,52.47)
  Bottom Layer w0.254: v1(5.68,71.37) 5.15,71.37 4.76,70.98 FPC2.3
USB_PORT_P: length 34.2
  Top Layer w0.254: v1(15.31,53.87) 16.27,54.82 16.27,57.5 19.06,60.29 19.06,68.41 16.98,70.5 v1(5.68,70.5)
  Bottom Layer w0.254: v1(5.68,70.5) 5.66,70.48 FPC2.4 ; v1(15.31,53.87) 13.76,53.87 13.74,53.88
$1N4467: length 76.5
  Top Layer w0.254: v1(48,53.18) 47.64,53.54 28.4,53.54 24.62,57.32 24.62,70.18 27.78,73.34 49.41,73.34 v1(51.54,75.47)
  Bottom Layer w0.254: v1(51.54,75.47) 51.38,75.63 1.2 ; RN2.1 46.02,53.18 46.03,53.19 46.05,53.18 v1(48,53.18)
$1N4468: length 60.7
  Top Layer w0.254: v1(32.23,75.52) 31.03,74.32 27.21,74.32 23.47,70.58 23.47,56.74 27.41,52.8 47.12,52.8 v1(48,51.92)
  Bottom Layer w0.254: v1(32.23,75.52) 32.32,75.61 2.2 ; v1(48,51.92) 46.04,51.92 U1.5 45.58,52.38 RN2.2
$1N4469: length 63.5
  Top Layer w0.254: v1(13.18,75.6) 17.52,75.6 22.36,70.76 22.36,55.99 26.39,51.96 46.7,51.96 v1(48.01,50.65)
  Bottom Layer w0.254: RN2.3 44.43,51.58 45.35,50.65 U1.4 48,50.65 v1(48.01,50.65) ; 3.2 13.26,75.68 v1(13.18,75.6)
$1N4471: length 42.4
  Top Layer w0.254: v1(18.07,57.18) 19.25,57.18 25.28,51.15 46.26,51.15 v1(48.03,49.38)
  Bottom Layer w0.254: RN2.4 44.82,49.38 U1.3 46.04,49.38 v1(48.03,49.38) ; v1(18.07,57.18) 18.05,57.19 4.2
$1N4472: length 22
  Top Layer w0.254: v1(60.93,56.44) 58.07,53.58 50.02,53.58 v1(49.62,53.18)
  Bottom Layer w0.254: v1(49.62,53.18) 51.49,53.18 51.5,53.19 51.52,53.18 RN1.4 ; v1(60.93,56.44) 60.9,56.46 8.2
$1N4473: length 28.5
  Top Layer w0.254: v1(65.65,45.34) 65.65,46.93 61.41,51.17 51.39,51.17 v1(49.61,49.39)
  Bottom Layer w0.254: v1(65.65,45.34) 65.66,45.32 5.2 ; v1(49.61,49.39) 51.5,49.39 U1.14 52.76,49.38 RN1.1
$1N4474: length 60
  Top Layer w0.254: v1(49.62,50.62) 50.98,51.98 62.26,51.98 66.7,47.53 66.7,38.15 64.79,36.24 47.73,36.24 v1(46.53,37.44)
  Bottom Layer w0.254: v1(46.53,37.44) 46.61,37.52 6.2 ; RN1.2 52.99,51.58 52.06,50.65 U1.13 51.47,50.62 v1(49.62,50.62)
$1N4475: length 64.6
  Top Layer w0.254: v1(41.78,70.99) 42.97,72.18 60.07,72.18 62.22,70.03 62.22,56.24 58.77,52.79 50.5,52.79 v1(49.62,51.91)
  Bottom Layer w0.254: v1(49.62,51.91) 51.49,51.91 U1.12 51.96,52.38 RN1.3 ; 7.2 41.85,70.91 v1(41.78,70.99)
$1N4481: length 42.4
  Top Layer w0.254: v1(162.36,53.17) 161.8,53.73 157.72,53.73 157.13,54.32 157.13,68.08 153.08,72.13 149.99,72.13 v1(146.65,75.47)
  Bottom Layer w0.254: RN7.5 160.37,53.19 160.38,53.19 160.4,53.17 v1(162.36,53.17) ; 25.2 146.63,75.48 v1(146.65,75.47)
$1N4482: length 18.9
  Top Layer w0.254: v1(156.16,56.57) 156.16,54.12 157.43,52.85 161.42,52.85 v1(162.35,51.92)
  Bottom Layer w0.254: RN7.6 159.91,52.39 U4.5 160.38,51.92 v1(162.35,51.92) ; v1(156.16,56.57) 156.15,56.57 26.2
$1N4483: length 54.5
  Top Layer w0.254: v1(162.36,50.64) 160.96,52.04 148.93,52.04 144.23,47.34 144.23,37.25 146.16,35.32 148.98,35.32 v1(151.41,32.89)
  Bottom Layer w0.254: RN7.7 158.76,51.59 159.69,50.65 U4.4 160.39,50.64 v1(162.36,50.64) ; 27.2 v1(151.41,32.89)
$1N4484: length 55.6
  Top Layer w0.254: v1(162.36,49.39) 160.52,51.23 149.62,51.23 145.17,46.78 145.17,37.8 146.79,36.18 159.61,36.18 v1(160.96,37.53)
  Bottom Layer w0.254: 28.2 160.92,37.56 v1(160.96,37.53) ; RN7.8 159.19,49.38 U4.3 162.35,49.38 v1(162.36,49.39)
$1N4485: length 21.4
  Top Layer w0.254: v1(163.81,53.22) 164.27,53.68 171.11,53.68 v1(175.1,57.67)
  Bottom Layer w0.254: RN8.8 165.86,53.19 165.85,53.19 165.83,53.22 v1(163.81,53.22) ; v1(175.1,57.67) 175.2,57.77 32.2
$1N4486: length 28.7
  Top Layer w0.254: v1(179.99,45.23) 179.99,46.79 175.51,51.27 165.71,51.27 v1(163.82,49.38)
  Bottom Layer w0.254: v1(163.82,49.38) 165.85,49.38 U4.14 167.06,49.38 RN8.5 ; v1(179.99,45.23) 179.98,45.22 29.2
$1N4487: length 56
  Top Layer w0.254: v1(170.33,26.54) 170.33,33.21 173.32,36.2 178.26,36.2 180.77,38.71 180.77,47.24 175.98,52.03 165.2,52.03 v1(163.8,50.63)
  Bottom Layer w0.254: v1(170.33,26.54) 170.47,26.4 30.2 ; v1(163.8,50.63) 165.82,50.63 U4.13 166.32,50.65 167.26,51.59 RN8.6
$1N4488: length 48.9
  Top Layer w0.254: v1(163.81,51.9) 164.8,52.89 171.91,52.89 176.21,57.19 176.21,68.27 172.37,72.11 169.02,72.11 v1(165.63,75.5)
  Bottom Layer w0.254: RN8.7 166.32,52.39 U4.12 165.82,51.9 v1(163.81,51.9) ; v1(165.63,75.5) 165.68,75.55 31.2
$1N4493: length 37.8
  Top Layer w0.254: v1(280.62,53.18) 277.29,53.18 276.26,54.21 276.26,69.68 v1(270.44,75.5)
  Bottom Layer w0.254: 270.45,80.25 270.45,75.51 v1(270.44,75.5) ; v1(280.62,53.18) 278.63,53.18 U7.6 278.61,53.2 RN13.5
$1N4494: length 18.2
  Top Layer w0.254: v1(280.61,51.9) 280.07,52.44 276.83,52.44 275.24,54.03 v1(275.24,58.15)
  Bottom Layer w0.254: v1(275.24,58.15) 275.22,58.16 50.2 ; RN13.6 278.14,52.4 U7.5 278.64,51.9 v1(280.61,51.9)
$1N4495: length 39.8
  Top Layer w0.254: v1(280.61,50.66) 279.66,51.61 277.28,51.61 275.5,49.83 275.5,43.18 279.52,39.16 279.52,27.26 v1(279.48,27.22)
  Bottom Layer w0.254: 51.2 279.97,26.72 v1(279.48,27.22) ; v1(280.61,50.66) 278.64,50.66 U7.4 277.93,50.64 276.98,51.6 RN13.7
$1N4496: length 70.6
  Top Layer w0.254: v1(299.11,8.95) 299.11,13.29 296.04,16.36 286.83,16.36 280.82,22.37 280.82,39.29 276.51,43.6 276.51,49.42 277.93,50.84 279.13,50.84 v1(280.59,49.38)
  Bottom Layer w0.254: v1(299.11,8.95) 299.03,8.87 52.2 ; RN13.8 277.45,49.37 U7.3 278.63,49.38 v1(280.59,49.38)
$1N4497: length 44.7
  Top Layer w0.254: v1(281.94,53.16) 281.94,68.21 286.07,72.34 295.91,72.34 v1(295.92,72.33)
  Bottom Layer w0.254: v1(295.92,72.33) 299.03,75.44 56.2 ; RN14.8 284.1,53.18 U7.11 284.07,53.16 v1(281.94,53.16)
$1N4498: length 30
  Top Layer w0.254: v1(299.04,47.14) 294.89,51.29 283.86,51.29 v1(281.94,49.37)
  Bottom Layer w0.254: 53.2 299.03,47.13 v1(299.04,47.14) ; v1(281.94,49.37) 284.09,49.37 U7.14 285.29,49.37 RN14.5
$1N4499: length 45.9
  Top Layer w0.254: v1(299.02,28.1) 299.02,32.2 295.32,35.9 285.87,35.9 281.27,40.5 281.27,50.01 v1(281.94,50.68)
  Bottom Layer w0.254: RN14.6 285.68,51.58 284.74,50.64 U7.13 284.06,50.68 v1(281.94,50.68) ; v1(299.02,28.1) 299.03,28.08 54.2
$1N4500: length 27.7
  Top Layer w0.254: v1(281.94,51.92) 282.39,52.37 293.26,52.37 v1(299.05,58.16)
  Bottom Layer w0.254: v1(281.94,51.92) 284.09,51.92 U7.12 284.56,52.38 RN14.7 ; v1(299.05,58.16) 299.03,58.17 55.2
$1N4504: length 138.9
  Top Layer w0.254: v1(56.18,18.31) 57.67,16.82 175.41,16.82 177.22,15.01 v1(184.31,15.01)
  Bottom Layer w0.254: v1(56.18,18.31) 56.15,18.33 57.2 ; v1(184.31,15.01) 182.32,15.01 U8.6 182.29,15.03 179.68,15.03
$1N4505: length 137.1
  Top Layer w0.254: v1(184.31,13.74) 183.82,14.23 176.61,14.23 175,15.84 65.84,15.84 63.15,13.15 v1(63.15,8.8)
  Bottom Layer w0.254: RN15.6 181.82,14.23 U8.5 182.32,13.74 v1(184.31,13.74) ; 58.2 63.28,8.66 v1(63.15,8.8)
$1N4506: length 64.7
  Top Layer w0.254: v1(134.69,11.81) 134.78,11.81 137.8,14.83 174.55,14.83 175.95,13.43 183.34,13.43 v1(184.31,12.46)
  Bottom Layer w0.254: 179.68,13.43 180.68,13.43 181.65,12.46 U8.4 182.33,12.46 v1(184.31,12.46) ; v1(134.69,11.81) 134.69,4.09 59.2
$1N4507: length 40.7
  Top Layer w0.254: v1(184.32,10.61) 184.32,8.79 185.56,7.55 187.61,7.55 189.15,9.09 189.15,11.2 191.49,13.54 v1(203.94,13.54)
  Bottom Layer w0.254: 60.2 203.78,13.38 v1(203.94,13.54) ; RN15.8 181.12,11.19 U8.3 183.73,11.19 v1(184.32,10.61)
$1N4508: length 110.5
  Top Layer w0.254: v1(279.89,13.81) 276.88,16.82 189.88,16.82 188.04,14.98 v1(185.81,14.98)
  Bottom Layer w0.254: RN16.8 190.4,15 U8.11 187.76,14.98 v1(185.81,14.98) ; 64.2 279.98,13.71 v1(279.89,13.81)
$1N4510: length 72.6
  Top Layer w0.254: v1(241.83,13.87) 240.42,15.28 190.73,15.28 187.88,12.43 v1(185.82,12.43)
  Bottom Layer w0.254: 241.88,4.04 241.83,4.09 v1(241.83,13.87) ; v1(185.82,12.43) 185.85,12.46 U8.13 188.35,12.46 189.3,13.41 RN16.6
$1N4511: length 91.6
  Top Layer w0.254: v1(185.81,13.75) 188.03,13.75 190.31,16.03 258.78,16.03 v1(260.94,13.87)
  Bottom Layer w0.254: RN16.7 188.27,14.21 U8.12 187.78,13.75 v1(185.81,13.75) ; 260.93,4.04 260.93,13.86 v1(260.94,13.87)
$1N4526: length 48.8
  Top Layer w0.254: v1(20.41,37.4) 26.7,31.11 26.7,18.48 30.16,15.02 v1(43.29,15.02)
  Bottom Layer w0.254: 65.2 20.44,37.43 v1(20.41,37.4) ; v1(43.29,15.02) 41.35,15.02 U10.6 41.33,15.01 RN19.5
$1N4527: length 29.5
  Top Layer w0.254: v1(25.18,18.33) 29.23,14.28 42.79,14.28 v1(43.3,13.77)
  Bottom Layer w0.254: v1(25.18,18.33) 25.2,18.35 66.2 ; RN19.6 40.89,14.21 U10.5 41.36,13.77 v1(43.3,13.77)
$1N4534: length 49.1
  Top Layer w0.254: v1(89.42,75.49) 92.87,72.04 95.9,72.04 100.09,67.85 100.09,56.73 96.18,52.82 88.48,52.82 v1(87.58,51.92)
  Bottom Layer w0.254: RN4.7 90.08,52.39 U2.12 89.61,51.92 v1(87.58,51.92) ; v1(89.42,75.49) 89.48,75.55 15.2
$1N4535: length 55.8
  Top Layer w0.254: v1(87.59,50.67) 88.93,52.01 99.69,52.01 104.94,46.76 104.94,39.02 102.15,36.23 97.62,36.23 v1(94.28,32.89)
  Bottom Layer w0.254: v1(94.28,32.89) 94.26,32.87 14.2 ; v1(87.59,50.67) 89.6,50.67 U2.13 90.23,50.65 91.17,51.59 RN4.6
$1N4536: length 28.6
  Top Layer w0.254: v1(103.76,45.53) 103.76,46.65 99.18,51.23 89.46,51.23 v1(87.58,49.35)
  Bottom Layer w0.254: 13.2 103.77,45.51 v1(103.76,45.53) ; RN4.5 90.8,49.38 U2.14 89.58,49.35 v1(87.58,49.35)
$1N4537: length 21.9
  Top Layer w0.254: v1(87.58,53.18) 88,53.6 95.7,53.6 v1(98.93,56.83)
  Bottom Layer w0.254: 16.2 99,56.9 v1(98.93,56.83) ; v1(87.58,53.18) 89.6,53.18 89.62,53.19 89.62,53.19 RN4.8
$1N4538: length 53.4
  Top Layer w0.254: v1(86.1,49.38) 86.06,49.38 84.21,51.23 74.3,51.23 70.26,47.19 70.26,37.61 71.7,36.17 83.59,36.17 84.69,37.27 v1(84.69,37.39)
  Bottom Layer w0.254: v1(84.69,37.39) 84.72,37.42 12.2 ; RN3.8 82.96,49.38 U2.3 84.15,49.38 v1(86.1,49.38)
$1N4539: length 52.3
  Top Layer w0.254: v1(75.22,32.29) 72.41,35.1 70.85,35.1 69.08,36.87 69.08,47.46 73.64,52.02 84.78,52.02 v1(86.12,50.68)
  Bottom Layer w0.254: 11.2 75.2,32.27 v1(75.22,32.29) ; RN3.7 82.55,51.6 83.49,50.65 U2.4 84.17,50.68 v1(86.12,50.68)
$1N4540: length 18.5
  Top Layer w0.254: v1(79.92,56.49) 79.92,54.88 81.96,52.84 85.21,52.84 v1(86.11,51.94)
  Bottom Layer w0.254: 10.2 79.95,56.52 v1(79.92,56.49) ; RN3.6 83.67,52.4 U2.5 84.16,51.94 v1(86.11,51.94)
$1N4541: length 42
  Top Layer w0.254: v1(70.34,75.61) 73.93,72.02 77.22,72.02 81.04,68.2 81.04,55.12 82.51,53.65 85.64,53.65 v1(86.12,53.17)
  Bottom Layer w0.254: v1(70.34,75.61) 70.43,75.7 9.2 ; v1(86.12,53.17) 84.17,53.17 84.15,53.19 84.14,53.2 RN3.5
$1N4545: length 44
  Top Layer w0.254: v1(245.97,51.92) 246.93,52.88 250.16,52.88 252.4,55.12 252.4,68.29 248.41,72.28 245.27,72.28 v1(241.97,75.58)
  Bottom Layer w0.254: 47.2 241.87,75.67 v1(241.97,75.58) ; v1(245.97,51.92) 247.94,51.92 247.96,51.89 248.41,52.34 RN12.7
$1N4546: length 65.6
  Top Layer w0.254: v1(245.97,50.61) 247.4,52.04 264.74,52.04 269.3,47.48 269.3,39.29 266.11,36.1 259.52,36.1 253.73,30.31 v1(253.73,26.52)
  Bottom Layer w0.254: 46.2 253.79,26.45 v1(253.73,26.52) ; v1(245.97,50.61) 247.95,50.61 U6.13 248.44,50.62 249.36,51.54 RN12.6
$1N4547: length 35
  Top Layer w0.254: v1(268.08,45.41) 268.08,47.32 264.1,51.3 247.93,51.3 v1(245.98,49.35)
  Bottom Layer w0.254: 45.2 268.08,45.4 v1(268.08,45.41) ; RN12.5 249.27,49.35 U6.14 247.96,49.35 v1(245.98,49.35)
$1N4548: length 16.9
  Top Layer w0.254: v1(245.97,53.13) 246.48,53.64 249.69,53.64 251.38,55.33 v1(251.38,56.53)
  Bottom Layer w0.254: RN12.8 250.63,53.16 U6.11 247.93,53.13 v1(245.97,53.13) ; v1(251.38,56.53) 251.41,56.56 48.2
$1N4549: length 62.1
  Top Layer w0.254: v1(237.26,37.56) 235.81,36.11 223.03,36.11 221.19,37.95 221.19,46.84 225.63,51.28 242.55,51.28 v1(244.47,49.36)
  Bottom Layer w0.254: RN11.8 241.25,49.35 U6.3 242.5,49.36 v1(244.47,49.36) ; 44.2 237.13,37.68 v1(237.26,37.56)
$1N4550: length 60.4
  Top Layer w0.254: v1(244.45,50.62) 243.04,52.03 224.98,52.03 220.43,47.48 220.43,37.36 222.5,35.29 225.16,35.29 v1(227.61,32.84)
  Bottom Layer w0.254: v1(244.45,50.62) 242.5,50.62 U6.4 241.73,50.62 240.81,51.55 RN11.7 ; 43.2 227.62,32.82 v1(227.61,32.84)
$1N4551: length 23.5
  Top Layer w0.254: v1(232.31,56.56) 235.95,52.92 243.46,52.92 v1(244.46,51.92)
  Bottom Layer w0.254: v1(232.31,56.56) 232.35,56.6 42.2 ; RN11.6 242.04,52.35 242.49,51.89 242.52,51.92 v1(244.46,51.92)
$1N4552: length 47.4
  Top Layer w0.254: v1(244.47,53.13) 243.96,53.64 236.29,53.64 233.3,56.63 233.3,68.61 229.71,72.2 226.03,72.2 v1(222.78,75.45)
  Bottom Layer w0.254: v1(222.78,75.45) 222.82,75.49 41.2 ; RN11.5 242.48,53.15 U6.6 242.53,53.13 v1(244.47,53.13)
$1N4555: length 56.3
  Top Layer w0.254: v1(208.54,32.85) 208.54,33.2 211.49,36.15 216.35,36.15 219.27,39.07 219.27,47.11 214.32,52.06 203.35,52.06 v1(201.95,50.66)
  Bottom Layer w0.254: RN10.6 205.4,51.6 204.45,50.65 U5.13 203.96,50.66 v1(201.95,50.66) ; v1(208.54,32.85) 208.57,32.81 38.2
$1N4556: length 21.5
  Top Layer w0.254: v1(201.96,53.2) 202.46,53.7 209.58,53.7 v1(213.28,57.4)
  Bottom Layer w0.254: v1(201.96,53.2) 203.96,53.2 203.97,53.19 206.58,53.19 RN10.8 ; v1(213.28,57.4) 213.3,57.42 40.2
$1N4557: length 53.8
  Top Layer w0.254: v1(198.97,37.47) 197.7,36.2 186.21,36.2 184.76,37.65 184.76,48.53 187.51,51.28 198.6,51.28 v1(200.5,49.38)
  Bottom Layer w0.254: 36.2 199.03,37.53 v1(198.97,37.47) ; RN9.8 197.31,49.38 U5.3 198.5,49.38 v1(200.5,49.38)
$1N4558: length 19.2
  Top Layer w0.254: v1(194.2,56.45) 194.2,53.86 195.11,52.95 199.45,52.95 v1(200.48,51.92)
  Bottom Layer w0.254: RN9.6 198.03,52.39 U5.5 198.5,51.92 v1(200.48,51.92) ; 34.2 194.25,56.5 v1(194.2,56.45)
$1N4559: length 28.8
  Top Layer w0.254: v1(201.95,49.38) 203.87,51.3 213.77,51.3 218.1,46.97 v1(218.1,45.42)
  Bottom Layer w0.254: RN10.5 205.17,49.38 U5.14 203.96,49.38 v1(201.95,49.38) ; v1(218.1,45.42) 218.08,45.4 37.2
$1N4560: length 49
  Top Layer w0.254: v1(201.95,51.92) 202.97,52.94 210.42,52.94 214.24,56.76 214.24,68.44 210.58,72.1 207.13,72.1 v1(203.76,75.47)
  Bottom Layer w0.254: v1(201.95,51.92) 203.96,51.92 U5.12 204.44,52.4 RN10.7 ; 39.2 203.77,75.48 v1(203.76,75.47)
$1N4561: length 52.4
  Top Layer w0.254: v1(200.48,50.67) 199.13,52.02 186.94,52.02 183.97,49.05 183.97,37 185.65,35.32 187.06,35.32 v1(189.48,32.9)
  Bottom Layer w0.254: 35.2 189.52,32.86 v1(189.48,32.9) ; RN9.7 196.89,51.59 197.82,50.65 U5.4 198.51,50.67 v1(200.48,50.67)
$1N4562: length 42.6
  Top Layer w0.254: v1(200.48,53.2) 199.94,53.74 195.74,53.74 195.14,54.33 195.14,68.33 191.32,72.16 187.98,72.16 v1(184.69,75.45)
  Bottom Layer w0.254: RN9.5 198.49,53.19 198.49,53.19 200.47,53.19 v1(200.48,53.2) ; v1(184.69,75.45) 184.73,75.49 33.2
$1N4563: length 38.6
  Bottom Layer w0.254: U2.9 87.19,55.73 86.54,55.08 82.7,55.08 82.08,54.46 U1.10
$1N4564: length 38.6
  Bottom Layer w0.254: U3.9 125.32,55.73 124.68,55.09 120.85,55.09 120.22,54.46 U2.10
$1N4565: length 40.1
  Bottom Layer w0.254: U3.10 141.05,54.46 142.83,56.24 145.28,56.24 147.05,54.46 158.01,54.46 158.64,55.09 162.79,55.09 163.43,55.73 U4.9
$1N4566: length 38.6
  Bottom Layer w0.254: U5.9 201.56,55.73 200.92,55.09 196.87,55.09 196.24,54.46 U4.10
$1N4567: length 44.5
  Bottom Layer w0.254: U5.10 240.37,54.46 240.95,55.04 244.91,55.04 245.57,55.7 U6.9
$1N4568: length 37.2
  Bottom Layer w0.254: U7.9 283.5,56.32 269.9,56.32 268.01,54.43 U6.10
$1N4569: length 128.1
  Top Layer w0.254: v1(189.85,17.56) 253.47,17.56 255.08,19.17 255.08,29.91 260.27,35.1 267.05,35.1 270.51,38.56 v1(270.51,55.08)
  Bottom Layer w0.254: U7.10 281.62,54.45 281,55.08 v1(270.51,55.08) ; v1(189.85,17.56) 189.83,17.54 U8.9
$1N4571: length 141.5
  Top Layer w0.254: v1(185.06,16.32) 183.79,17.59 v1(74.81,17.59)
  Bottom Layer w0.254: U8.10 185.1,16.27 v1(185.06,16.32) ; 46.81,17.56 74.78,17.56 v1(74.81,17.59)
$1N4590: length 2.6
  Bottom Layer w0.254: RN20.8 49.36,15.02 U10.11
$1N4591: length 2.8
  Bottom Layer w0.254: U10.12 47.26,14.2 RN20.7
$1N4592: length 3
  Bottom Layer w0.254: U10.13 47.38,12.48 48.3,13.4 RN20.6
$1N4593: length 3.1
  Bottom Layer w0.254: RN20.5 48,11.21 U10.14
$1N4614: length 55.6
  Top Layer w0.254: v1(122.87,37.37) 121.68,36.18 108.67,36.18 107.2,37.65 107.2,46.79 111.61,51.2 122.43,51.2 v1(124.25,49.38)
  Bottom Layer w0.254: v1(124.25,49.38) 122.27,49.38 U3.3 121,49.38 RN5.8 ; v1(122.87,37.37) 122.82,37.41 20.2
$1N4615: length 54.1
  Top Layer w0.254: v1(124.25,50.64) 122.84,52.05 111.21,52.05 106.35,47.19 106.35,37.15 108.09,35.41 110.68,35.41 v1(113.26,32.83)
  Bottom Layer w0.254: 19.2 113.31,32.78 v1(113.26,32.83) ; RN5.7 120.54,51.61 121.5,50.65 U3.4 122.28,50.64 v1(124.25,50.64)
$1N4616: length 18.9
  Top Layer w0.254: v1(124.25,51.94) 123.3,52.89 119.75,52.89 118,54.64 v1(118,56.56)
  Bottom Layer w0.254: v1(124.25,51.94) 122.28,51.94 U3.5 121.77,52.41 RN5.6 ; 18.2 118.05,56.61 v1(118,56.56)
$1N4617: length 41.6
  Top Layer w0.254: v1(124.25,53.2) 123.74,53.71 120.85,53.71 119.21,55.35 119.21,67.55 114.64,72.12 111.95,72.12 v1(108.5,75.57)
  Bottom Layer w0.254: 17.2 108.53,75.6 v1(108.5,75.57) ; v1(124.25,53.2) 122.27,53.2 122.26,53.19 122.24,53.21 RN5.5
$1N4618: length 48.7
  Top Layer w0.254: v1(125.78,51.93) 126.73,52.88 134.09,52.88 138.1,56.89 138.1,68.12 134.13,72.09 131.06,72.09 v1(127.62,75.53)
  Bottom Layer w0.254: v1(127.62,75.53) 127.58,75.56 23.2 ; RN6.7 128.22,52.41 U3.12 127.73,51.93 v1(125.78,51.93)
$1N4619: length 56.1
  Top Layer w0.254: v1(132.38,29.23) 132.38,33.37 135.22,36.21 140.11,36.21 143,39.1 143,46.94 137.87,52.07 127.22,52.07 v1(125.78,50.63)
  Bottom Layer w0.254: v1(132.38,29.23) 132.36,29.21 22.2 ; RN6.6 129.3,51.61 128.34,50.65 U3.13 127.71,50.63 v1(125.78,50.63)
$1N4620: length 28.4
  Top Layer w0.254: v1(125.79,49.37) 127.67,51.25 137.1,51.25 141.84,46.51 v1(141.84,45.57)
  Bottom Layer w0.254: v1(141.84,45.57) 141.87,45.53 21.2 ; RN6.5 128.94,49.38 U3.14 127.72,49.37 v1(125.79,49.37)
$1N4621: length 21.6
  Top Layer w0.254: v1(137.09,57.16) 133.61,53.68 126.26,53.68 v1(125.78,53.2)
  Bottom Layer w0.254: v1(137.09,57.16) 137.1,57.17 137.1,61.21 ; RN6.8 130.35,53.19 127.73,53.19 127.73,53.2 v1(125.78,53.2)
$1N10681: length 15
  Top Layer w0.254: v1(43.35,10.42) 40.61,10.42 39.47,9.28 v1(39.47,8.06)
  Bottom Layer w0.254: 68.2 v1(39.47,8.06) ; v1(43.35,10.42) 42.55,11.21 U10.3 40.2,11.21 RN19.8
$1N10690: length 39.4
  Top Layer w0.254: v1(15.65,8.49) 20.57,13.41 42.36,13.41 v1(43.29,12.48)
  Bottom Layer w0.254: v1(43.29,12.48) 41.35,12.48 U10.4 40.53,12.48 39.61,13.41 RN19.7 ; 67.2 v1(15.65,8.49)
$3N6224: length 23.1
  Top Layer w0.254: U16.2 52.73,10.34 51.38,11.69 U17.4
$3N6227: length 22.8
  Top Layer w0.254: v1(28.7,10.34) 31.42,10.34 ; 9.2,11.65 9.2,11.66 v1(10.47,11.66)
  Bottom Layer w0.254: v1(28.7,10.34) 21.33,10.34 20.01,11.66 v1(10.47,11.66)
$3N6231: length 35.8
  Top Layer w0.254: 7.42,10.5 4.83,10.5 2.74,12.6 2.74,27.51 4.73,29.5 U19.4
$3N6233: length 30.2
  Top Layer w0.254: v1(27.9,30.9) 33.33,30.9 34.73,29.51 U20.4 ; U19.2 21.32,30.85 v1(21.37,30.89)
  Bottom Layer w0.254: v1(27.9,30.9) 27.89,30.89 v1(21.37,30.89)
$3N6237: length 18.3
  Top Layer w0.254: 49.5,30.86 57.47,30.86 58.82,29.51 U21.4
$3N6239: length 18.3
  Top Layer w0.254: U22.4 77.55,29.51 76.2,30.86 68.55,30.86
$3N6243: length 18.3
  Top Layer w0.254: 87.61,30.86 95.42,30.86 96.77,29.51 U23.4
$3N6245: length 18.3
  Top Layer w0.254: U24.4 115.77,29.51 114.42,30.86 106.66,30.86
$3N6249: length 53.5
  Top Layer w0.254: 125.71,30.86 128.47,30.86 v1(128.48,30.87) ; v1(116.52,15.14) 116.52,12.1 118.15,10.47 U25.4
  Bottom Layer w0.254: v1(128.48,30.87) 132.42,30.87 134.56,28.73 134.56,18.96 133.38,17.78 118.54,17.78 116.52,15.76 v1(116.52,15.14)
